# Altium project SKC_KONTROLER.PrjPcb (part 2 of 2)

## Sheet SKC_PSU.SchDoc: SKC PSU
size A4; Author: eldar6776@hotmail.com; DrawnBy: Eldar Dedić; Organization: PROVEN d.o.o.; Address1: Adema Buće 102; Address2: 71000 Sarajevo; Address3: Federacija BiH; Address4: Bosna i Hercegovina; DocumentNumber: DE2211213; Revision: 001; SheetNumber: 9; SheetTotal: 15; ProjectName: MIKSER SIROVINE
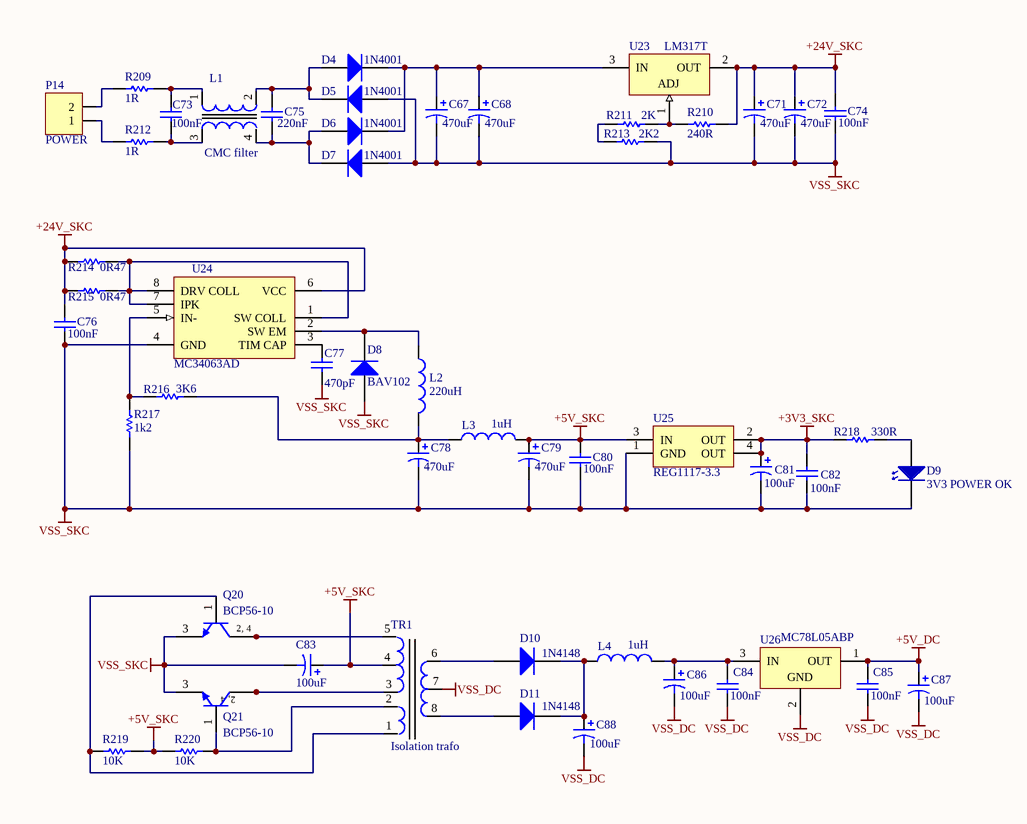
[diagram p6: SKC_PSU.SchDoc]

### Parts
C67  470uF  [CAPPR5-10X16]
C68  470uF  [CAPPR5-10X16]
C71  470uF  [CAPPR5-10X16]
C72  470uF  [CAPPR5-10X16]
C73  100nF  [VP60-3.6]
C74  value 100nF  [1206]
C75  220nF  [VP60-3.6]
C76  value 100nF  [1206]
C77  value 470pF  [0805]
C78  470uF  [CAPPR5-10X16]
C79  470uF  [CAPPR5-10X16]
C80  value 100nF  [1206]
C81  100uF  [CAPPR2-5X11]
C82  value 100nF  [1206]
C83  100uF  [CAPPR2-5X11]
C84  value 100nF  [1206]
C85  value 100nF  [1206]
C86  100uF  [CAPPR2-5X11]
C87  100uF  [CAPPR2-5X11]
C88  100uF  [CAPPR2-5X11]
D4  1N4001  [DO-41]
D5  1N4001  [DO-41]
D6  1N4001  [DO-41]
D7  1N4001  [DO-41]
D8  BAV102  [SOD80C]
D9  3V3 POWER OK  [LED 3mm]
D10  1N4148  [DO-35]
D11  1N4148  [DO-35]
L1  CMC filter  [MREZNI FILTER]
L2  value 220uH  [RB5-10.5]
L3  value 1uH  [RB5-10.5]
L4  value 1uH  [RB5-10.5]
P14  POWER  [TERMINAL BLOK 2]
Q20  BCP56-10  [SOT223_N]
Q21  BCP56-10  [SOT223_N]
R209  1R  [R6.35x2.3]
R210  240R  [ERA-0805]
R211  2K  [ERA-0805]
R212  1R  [R6.35x2.3]
R213  2K2  [ERA-0805]
R214  0R47  [RD6.35x2.3]
R215  0R47  [RD6.35x2.3]
R216  3K6  [ERA-0805]
R217  1k2  [ERA-0805]
R218  330R  [ERA-0603]
R219  10K  [ERA-0805]
R220  10K  [ERA-0805]
TR1  Isolation trafo  [ISOLATION TRAFO 1]
U23  LM317T  [221A-04]
U24  MC34063AD  [626-05]
U25  REG1117-3.3  [ZZ311]
U26  MC78L05ABP  [29-04]

### Nets
+3V3_SKC: C81.1 C82.2 R218.1 U25.2(OUT) U25.4(OUT)
+5V_DC: C85.2 C87.1 U26.1(OUT)
+5V_SKC: C79.1 C80.2 C83.1 L3.2 R219.1 R220.2 TR1.4 U25.3(IN)
+24V_SKC: C71.1 C72.1 C74.2 C76.2 R210.1 R214.1 R215.1 U23.2(OUT) U24.6(VCC)
VSS_DC: C84.1 C85.1 C86.2 C87.2 C88.2 TR1.7 U26.2(GND)
VSS_SKC: C67.2 C68.2 C71.2 C72.2 C74.1 C76.1 C77.1 C78.2 C79.2 C80.1 C81.2 C82.1 C83.2 D5.1(A) D7.1(A) D8.1(A) D9.1 Q20.3(E) Q21.3(E) R213.1 R217.1 U24.4(GND) U25.1(GND)
NetC67_1: C67.1 C68.1 D4.2(K) D6.2(K) U23.3(IN)
NetC73_1: C73.1 L1.3 R212.1
NetC73_2: C73.2 L1.1 R209.1
NetC75_1: C75.1 D6.1(A) D7.2(K) L1.4
NetC75_2: C75.2 D4.1(A) D5.2(K) L1.2
NetC77_2: C77.2 U24.3(TIM_CAP)
NetC78_1: C78.1 L2.2 L3.1 R216.2
NetC84_2: C84.2 C86.1 L4.2 U26.3(IN)
NetC88_1: C88.1 D10.2(K) D11.2(K) L4.1
NetD8_2: D8.2(K) L2.1 U24.2(SW_EM)
NetD9_2: D9.2 R218.2
NetD10_1: D10.1(A) TR1.6
NetD11_1: D11.1(A) TR1.8
NetP14_1: P14.1 R212.2
NetP14_2: P14.2 R209.2
NetQ20_1: Q20.1(B) R219.2 TR1.1
NetQ20_2: Q20.2(C) Q20.4(C) TR1.5
NetQ21_1: Q21.1(B) R220.1 TR1.2
NetQ21_2: Q21.2(C) Q21.4(C) TR1.3
NetR210_2: R210.2 R211.2 U23.1(ADJ)
NetR211_1: R211.1 R213.2
NetR214_2: R214.2 R215.2 U24.1(SW_COLL) U24.7(IPK) U24.8(DRV_COLL)
NetR216_1: R216.1 R217.2 U24.5(IN-)

### Notes on the sheet
- Title
- Size:
- Date:
- A4
- Number:
- Time:
- Revision:
- Sheet
- of
- File:
- (in symbol BCP56-10) 2, 4

### Library data of the parts
C67 C68 C71 C72 C78 C79 = EKA00DD347F00: Aluminum Electrolytic Capacitor, Radial Style with Long Leads: 470uF, 35V; Note: Refer to Manufacturer's Data Sheets for other lead formations; DrillSize: Nominal, Rounded To The Nearest 0.1mm; Published: 19-Mar-2004; DatasheetDocument: 20-Feb-2001; PackageReference: CAPPR5-10X16; Publisher: Altium Limited; ComponentLink1Description: Manufacturer Link; ComponentLink1URL: http://www.vishay.com/; ComponentLink2Description: Datasheet; ComponentLink2URL: http://www.vishay.com/docs/25014/eka.pdf; Value: 470uF
C73 C75 = VP60BA683KA: Dipped Radial Multilayer Ceramic Capacitor COG (NPO): 68nF, 50/63V; Published: 17-Dec-2003; LatestRevisionDate: 19-Mar-2004; LatestRevisionNote: PCB Footprint - Drill hole diameter reduced.; DatasheetDocument: 2-Jan-2002; PackageDocument: 2-Jan-2002; PackageReference: VP60-3.6; Publisher: Altium Limited; ComponentLink1Description: Manufacturer Link; ComponentLink1URL: http://www.vishay.com/; Value: 68nF
C74 C76 C80 C82 C84 C85 = C1206: Ceramic Chip Capacitor - Standard; Published: 17-Jul-2002; LatestRevisionDate: 19-Mar-2004; LatestRevisionNote: Silkscreen size reduced.; DatasheetDocument: Mar-2001; PackageDocument: Mar-2001; PackageReference: 1206; Publisher: Altium Limited; Code_JEITA: 1206; Code_IPC: 3216 [1206]; ComponentLink1Description: Manufacturer Link; ComponentLink1URL: http://www.kemet.com/; ComponentLink2Description: Datasheet; ComponentLink2URL: http://www.kemet.com/kemet/web/homepage/kechome.nsf/vapubfilesname/F3102TA.pdf/$file/F3102TA.pdf
C77 = C0805: Ceramic Chip Capacitor - Standard; Note: Footprint corresponds to dimensions for bulk cassette packaging. This case size has tightened tolerances.; Published: 17-Jul-2002; LatestRevisionDate: 19-Mar-2004; LatestRevisionNote: Silkscreen size reduced.; DatasheetDocument: Mar-2001; PackageDocument: Mar-2001; PackageReference: 0805; Publisher: Altium Limited; Code_JEITA: 0805; Code_IPC: 2012[0805]; ComponentLink1Description: Manufacturer Link; ComponentLink1URL: http://www.kemet.com/; ComponentLink2Description: Datasheet; ComponentLink2URL: http://www.kemet.com/kemet/web/homepage/kechome.nsf/vapubfilesname/F3102TA.pdf/$file/F3102TA.pdf
C81 C83 C86-C88 = EKA00AA310D00: Aluminum Electrolytic Capacitor, Radial Style with Long Leads: 100uF, 16V; Note: Refer to Manufacturer's Data Sheets for other lead formations; DrillSize: Nominal, Rounded To The Nearest 0.1mm; Published: 19-Mar-2004; DatasheetDocument: 20-Feb-2001; PackageReference: CAPPR2-5X11; Publisher: Altium Limited; ComponentLink1Description: Manufacturer Link; ComponentLink1URL: http://www.vishay.com/; ComponentLink2Description: Datasheet; ComponentLink2URL: http://www.vishay.com/docs/25014/eka.pdf; Value: 100uF
D4-D7 = Diode 1N4007: 1 Amp General Purpose Rectifier; Published: 8-Jun-2000; LatestRevisionDate: 17-Jul-2002; LatestRevisionNote: Re-released for DXP Platform.; DatasheetVersion: 1998; PackageVersion: Aug-1999; PackageReference: DO-41; Publisher: Altium Limited; PackageDescription: Diode, Axial; Body 5.2 x 2.7 mm (LxDia. max), Lead Dia. 0.86 mm (max); Code_JEDEC: DO-204-AL; ComponentLink1Description: Manufacturer Link; ComponentLink1URL: http://www.fairchildsemi.com/; ComponentLink2Description: Datasheet; ComponentLink2URL: http://www.fairchildsemi.com/ds/1N%2F1N4001.pdf
D8 = BAV102: General-purpose Diode; Published: 17-Sep-2003; LatestRevisionDate: 19-Mar-2004; LatestRevisionNote: Silkscreen size reduced.; DatasheetVersion: 17-Sep-1996; PackageVersion: Jan-2002; PackageReference: SOD80C; Publisher: Altium Limited; PackageDescription: Metal Electrode Face (MELF) Diode; Body 3.5 x 1.6 mm (LxDia); ComponentLink1Description: Manufacturer Link; ComponentLink1URL: http://www.semiconductors.philips.com/; ComponentLink2Description: Datasheet; ComponentLink2URL: http://www.semiconductors.philips.com/acrobat/datasheets/BAV100_2.pdf
D9 = LED 3mm
D10 D11 = Diode 1N4148: High Conductance Fast Diode; Published: 8-Jun-2000; LatestRevisionDate: 17-Jul-2002; LatestRevisionNote: Re-released for DXP Platform.; DatasheetVersion: 1997; PackageReference: DO-35; Publisher: Altium Limited; PackageDescription: Diode, Axial; Body 3.8 x 1.9 mm (LxDia. max), Lead Dia. 0.53 mm (max); Code_JEDEC: DO-204-AH; ComponentLink1Description: Manufacturer Link; ComponentLink1URL: http://www.fairchildsemi.com/; ComponentLink2Description: Datasheet; ComponentLink2URL: http://www.fairchildsemi.com/ds/1N%2F1N4148.pdf
L1 = MREZNI FILTER
L2-L4 = PCMC063T-R82MN: SMT Power Choke Coil; Size 7.3×6.6×3.0mm, ±20% Tolerance, 0.82uH, 13A; PCB_Layout: Complies with manufacturer's recommendation.; Published: 26-Sep-2008; DatasheetVersion: Oct-2007; PackageVersion: Oct-2007; PackageReference: PCMC063T; Publisher: Altium Limited; PackageDescription: SM Power Choke Coil; 2 Leads; Body 7.3 x 6.6 x 3.0 mm (LxWxH); ComponentLink1Description: Manufacturer Link; ComponentLink1URL: http://www.susumu.co.jp/; ComponentLink2Description: Datasheet; ComponentLink2URL: http://www.susumu.co.jp/english/pdf/products-j07-01.pdf
P14 = TERMINAL BLOK 2: Terminal blok konektor 3,5 mm
Q20 Q21 = BCP56-10: NPN Medium Power Transistor; Published: 17-Sep-2003; LatestRevisionDate: 12-Dec-2006; LatestRevisionNote: IPC-7351 Footprint Added.; DatasheetVersion: 10-Oct-2001; PackageVersion: Aug-2001; PackageReference: SOT223; Publisher: Altium Limited; PackageDescription: 4-Pin SOT-223 Package 2.3 mm Pitch, 7 mm Lead Span; ComponentLink1Description: Manufacturer Link; ComponentLink1URL: http://www.semiconductors.philips.com/; ComponentLink2Description: Datasheet; ComponentLink2URL: http://www.semiconductors.philips.com/acrobat/datasheets/BC639_BCP56_BCX56_7.pdf
R209 R212 = ERG12: Metal Oxide Film Resistor, 0.1 Ohm to 47k Ohm Range, 2% and 5% Tolerance, 0.5 W; Published: 17-Dec-2003; PackageReference: R6.35x2.3; Publisher: Altium Limited; ComponentLink1Description: Manufacturer Link; ComponentLink1URL: http://www.panasonic.com/industrial/components/resistive_products.htm; ComponentLink2Description: Datasheet; ComponentLink2URL: http://www.panasonic.com/industrial/components/pdf/AOA0000CE18.pdf
R210 R211 R213 R216 R217 R219 R220 = ERAS: Metal Film Thermosensitive Chip Resistor, 0.56 Ohm to 10k Ohm Range, 5% Tolerance, 0805 Size, 0.1 W; Note: If flow soldering, adjust pad width of PCB Footprint to 0.7 - 0.8 times the width of the resistor.; Published: 17-Dec-2003; LatestRevisionDate: 19-Mar-2004; LatestRevisionNote: Silkscreen size reduced.; PackageDocument: Mar-2003; PackageReference: ERA-0805; Publisher: Altium Limited; Code_IPC: 2012 [0805]; ComponentLink1Description: Manufacturer Link; ComponentLink1URL: http://www.panasonic.com/industrial/components/resistive_products.htm; ComponentLink2Description: Datasheet; ComponentLink2URL: http://www.panasonic.com/industrial/components/pdf/AOF0000CE1.pdf
R214 R215 = ERDS1T: Carbon Film Resistor, 1 Ohm to 3.3M Ohm Range, 5% Tolerance, 0.5 W; Published: 17-Dec-2003; PackageReference: RD6.35x2.3; Publisher: Altium Limited; ComponentLink1Description: Manufacturer Link; ComponentLink1URL: http://www.panasonic.com/industrial/components/resistive_products.htm; ComponentLink2Description: Datasheet; ComponentLink2URL: http://www.panasonic.com/industrial/components/pdf/AOA0000CE12.pdf
R218 = ERA3Y: Rectangular Thick Film Chip Resistor, 10 Ohm to 330k Ohm Range, 0.1% and 0.5% Tolerance, 0603 Size, 0.063 W; Note: If flow soldering, adjust pad width of PCB Footprint to 0.7 - 0.8 times the width of the resistor.; Published: 17-Dec-2003; LatestRevisionDate: 19-Mar-2004; LatestRevisionNote: Silkscreen size reduced.; PackageDocument: Mar-2003; PackageReference: ERA-0603; Publisher: Altium Limited; Code_IPC: 1608 [0603]; ComponentLink1Description: Manufacturer Link; ComponentLink1URL: http://www.panasonic.com/industrial/components/resistive_products.htm; ComponentLink2Description: Datasheet; ComponentLink2URL: http://www.panasonic.com/industrial/components/pdf/AOA0000CE8.pdf
TR1 = ISOLATION TRAFO 1: SMPS small ferite toroide trafo
U23 = LM317T: 3-Terminal Adjustable Positive Voltage Regulator; Note: Heatsink surface connected to pin 2.; Published: 17-Jul-2002; DatasheetVersion: 1988; PackageReference: 221A-04; Publisher: Altium Limited; PackageDescription: TO, Thru-Hole, Vertical, Heatsink Mounted; 3 In-Line Leads; Pitch 2.54 mm; Code_JEDEC: TO-262-AA; ComponentLink1Description: Manufacturer Link; ComponentLink1URL: http://www.onsemi.com/site/products/taxonomy/0,4438,503,00.html; ComponentLink2Description: Datasheet; ComponentLink2URL: http://www.onsemi.com/pub/Collateral/LM317-D.PDF
U24 = MC34063AD: DC-to-DC Converter Control Circuit; Published: 15-Apr-2002; LatestRevisionDate: 13-Apr-2006; LatestRevisionNote: IPC-7351 Footprint Added.; DatasheetVersion: 1996; PackageVersion: 1998; PackageReference: 751-05; Publisher: Altium Limited; PackageDescription: 8-Pin Small Outline Integrated Circuit 1.27 mm Pitch; Code_JEDEC: MS-012-AA; Code_IPC: SOIC127P600-8; ComponentLink1Description: Manufacturer Link; ComponentLink1URL: http://www.onsemi.com/site/products/taxonomy/0,4438,503,00.html; ComponentLink2Description: Datasheet; ComponentLink2URL: http://www.onsemi.com/pub/Collateral/MC34063A-D.PDF
U25 = REG1117-3.3: 800mA and 1A Low Dropout Positive Regulator 2.85V, 3.3V, 5V, and Adjustable; Published: 8-Jun-2000; LatestRevisionDate: 17-Jul-2002; LatestRevisionNote: Re-released for DXP Platform.; DatasheetVersion: Sep-1997; PackageVersion: revC; PackageReference: ZZ311; Publisher: Altium Limited; PackageDescription: SOT-223/SC-73; 4 Leads; Body 6.7 x 7.3 mm, inc. leads (LxW max); ComponentLink1Description: Manufacturer Link; ComponentLink1URL: http://www.ti.com/; ComponentLink2Description: Datasheet; ComponentLink2URL: http://www-s.ti.com/sc/ds/REG1117.pdf
U26 = MC78L05ABP: 3-Terminal Low-Current Positive Fixed Voltage Regulator; Published: 17-Jul-2002; DatasheetVersion: 1988; PackageVersion: 1996; PackageReference: 29-04; Publisher: Altium Limited; PackageDescription: TO, Flat Index; 3 In-Line, Axial Leads; Body Dia. 4.8mm; Leads 0.48 x 0.5 mm (max); ComponentLink1Description: Manufacturer Link; ComponentLink1URL: http://www.onsemi.com/site/products/taxonomy/0,4438,503,00.html; ComponentLink2Description: Datasheet; ComponentLink2URL: http://www.onsemi.com/pub/Collateral/MC78L00A-D.PDF

## Nets that join several sheets
+3V3_SKC: SignalAndKeyController (7 pins), SKC_DataComm (Q23.2 R128.1 U15.6), SKC_PSU (5 pins)
+5V_DC: SKC_DataComm (8 pins), SKC_PSU (C85.2 C87.1 U26.1)
+5V_SKC: SignalAndKeyController (6 pins), SignalOutput (15 pins), SKC_Display (15 pins), SKC_ErrrorDisplay (C65.2 R198.2 U22.16), KeyInput (40 pins), SKC_PSU (8 pins)
+24V_SKC: SKC_ErrrorDisplay (17 pins), SKC_PSU (9 pins)
VSS_DC: SKC_DataComm (11 pins), SKC_PSU (7 pins)
VSS_SKC: SignalAndKeyController (19 pins), SignalOutput (22 pins), SKC_DataComm (R133.1 U13.3 U15.4 U16.3), SKC_Display (23 pins), SKC_ErrrorDisplay (13 pins), KeyInput (48 pins), SKC_PSU (23 pins)
DISP1_LATCH: SignalAndKeyController (U12.2), SKC_Display (U17.12)
DISP2_LATCH: SignalAndKeyController (U12.3), SKC_Display (U18.12)
DISP3_LATCH: SignalAndKeyController (U12.4), SKC_Display (U19.12)
DISP4_LATCH: SignalAndKeyController (U12.5), SKC_Display (U20.12)
DISP5_LATCH: SignalAndKeyController (U12.6), SKC_Display (U21.12)
DISP_DIG_1: SignalAndKeyController (U12.9), SKC_Display (R161.2)
DISP_DIG_10: SignalAndKeyController (U12.10), SKC_Display (R171.2)
DISP_DIG_100: SignalAndKeyController (U12.7), SKC_Display (R181.2)
ERR1_LATCH: SignalAndKeyController (R221.1 U10.5), SKC_ErrrorDisplay (U22.12)
SH_CLK: SignalAndKeyController (U10.11 U11.11 U12.14), SignalOutput (5 pins), SKC_Display (5 pins), SKC_ErrrorDisplay (U22.11)
SH_DATA: SignalAndKeyController (U10.14 U11.14 U12.16), SignalOutput (5 pins), SKC_Display (5 pins), SKC_ErrrorDisplay (U22.14)
SIG1_LATCH: SignalAndKeyController (R226.1 U10.15), SignalOutput (U1.12)
SIG2_LATCH: SignalAndKeyController (R225.1 U10.1), SignalOutput (U2.12)
SIG3_LATCH: SignalAndKeyController (R224.1 U10.2), SignalOutput (U3.12)
SIG4_LATCH: SignalAndKeyController (R223.1 U10.3), SignalOutput (U4.12)
SIG5_LATCH: SignalAndKeyController (R222.1 U10.4), SignalOutput (U5.12)
SKC_DATA0: SignalAndKeyController (R114.2), KeyInput (U6.18 U7.18 U8.18 U9.18)
SKC_DATA1: SignalAndKeyController (R115.2), KeyInput (U6.16 U7.16 U8.16 U9.16)
SKC_DATA2: SignalAndKeyController (R117.2), KeyInput (U6.14 U7.14 U8.14 U9.14)
SKC_DATA3: SignalAndKeyController (R118.2), KeyInput (U6.12 U7.12 U8.12 U9.12)
SKC_DATA4: SignalAndKeyController (R119.2), KeyInput (U6.9 U7.9 U8.9 U9.9)
SKC_DATA5: SignalAndKeyController (R120.2), KeyInput (U6.7 U7.7 U8.7 U9.7)
SKC_DATA6: SignalAndKeyController (R121.2), KeyInput (U6.5 U7.5 U8.5 U9.5)
SKC_DATA7: SignalAndKeyController (R122.2), KeyInput (U6.3 U7.3 U8.3 U9.3)
SKC_DATA_DIR: SignalAndKeyController (U12.13), SKC_DataComm (R126.2)
SKC_DATA_RX: SignalAndKeyController (U12.18), SKC_DataComm (Q23.3 R133.2)
SKC_DATA_TX: SignalAndKeyController (U12.17), SKC_DataComm (R228.2)
SKC_INPUT_1_8: SignalAndKeyController (U11.15), KeyInput (U6.1 U6.19)
SKC_INPUT_9_16: SignalAndKeyController (U11.1), KeyInput (U7.1 U7.19)
SKC_INPUT_17_24: SignalAndKeyController (U11.2), KeyInput (U8.1 U8.19)
SKC_INPUT_25_32: SignalAndKeyController (U11.3), KeyInput (U9.1 U9.19)